# EAGLE schematic hd (EAGLE 9.2.2)
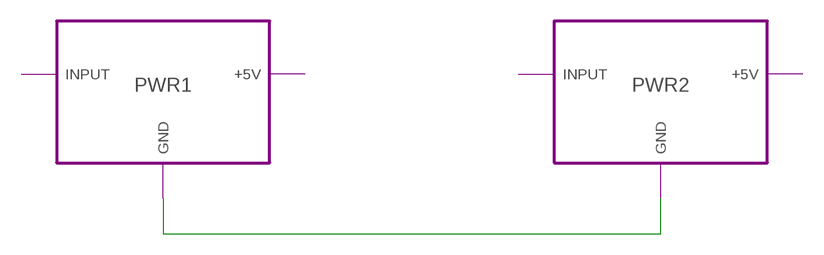
[diagram p0: schematic, sheet 1]

## Module instances
PWR1 = POWER
PWR2 = POWER

## Nets
N$1: port PWR1.GND PWR2.GND

## Library data of the parts

## Module POWER
Ports: +5V(out) INPUT(in) GND(pwr)
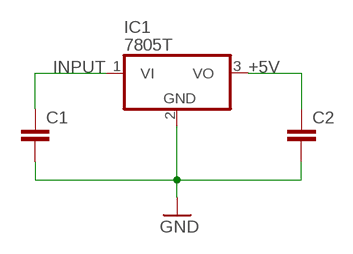
[diagram p1: schematic, module POWER, sheet 1]

### Parts
C1  C-EUC0805  [C0805]
C2  C-EUC0805  [C0805]
IC1  7805T  [TO220H]

### Nets
+5V: C2.1 IC1.3(VO)
GND: C1.2 C2.2 IC1.2(GND)
INPUT: C1.1 IC1.1(VI)

### Library data of the parts
C1 C2 = rcl:C-EU: CAPACITOR, European symbol; SPICEPREFIX: C
IC1 = linear:78*: Positive VOLTAGE REGULATOR Source: http://cache.national.com/ds/LM/LM78L05.pdf http://www.fairchildsemi.com/ds/LM/LM7805.pdf